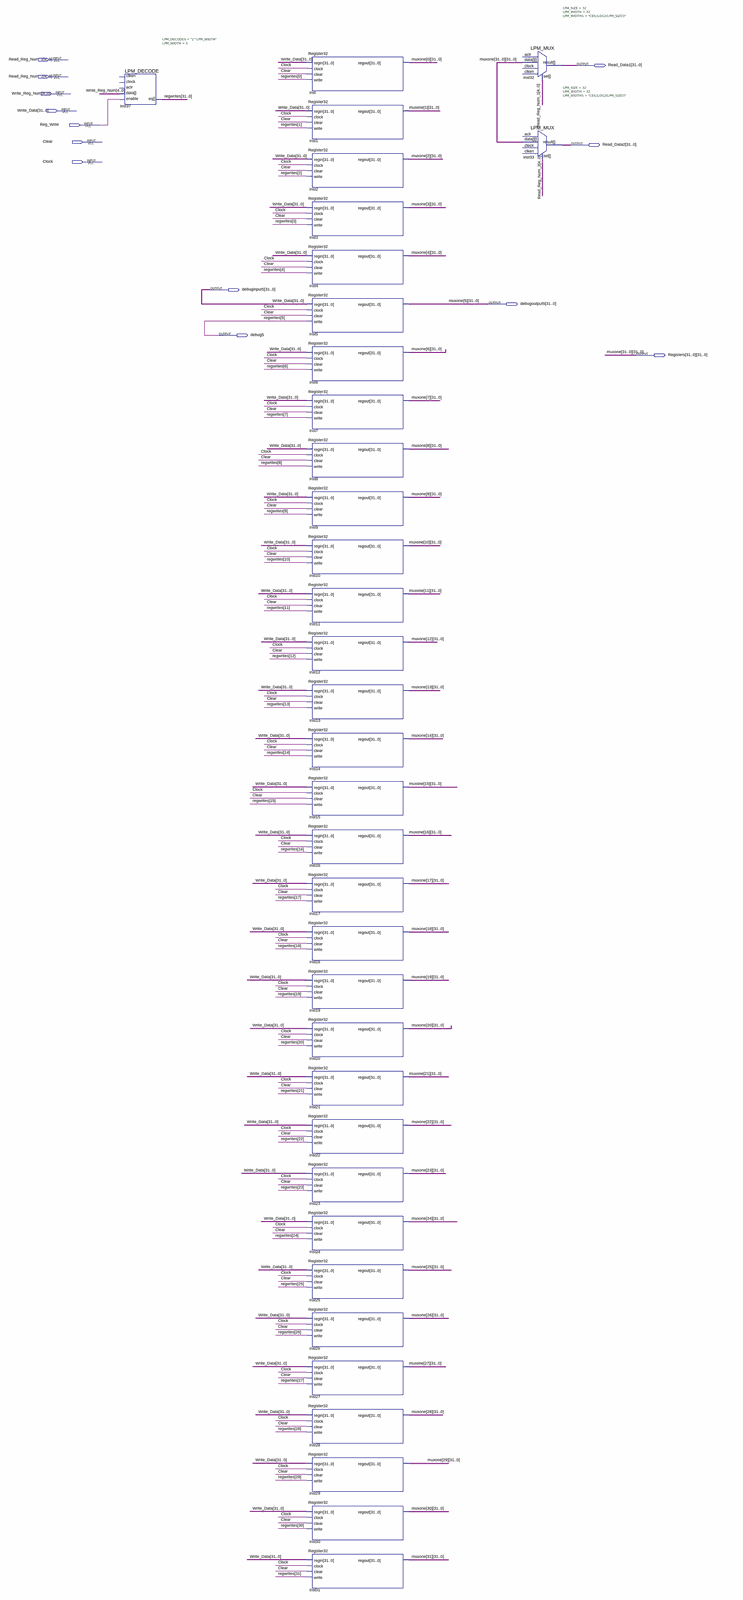
[diagram p0: schematic sheet, whole]
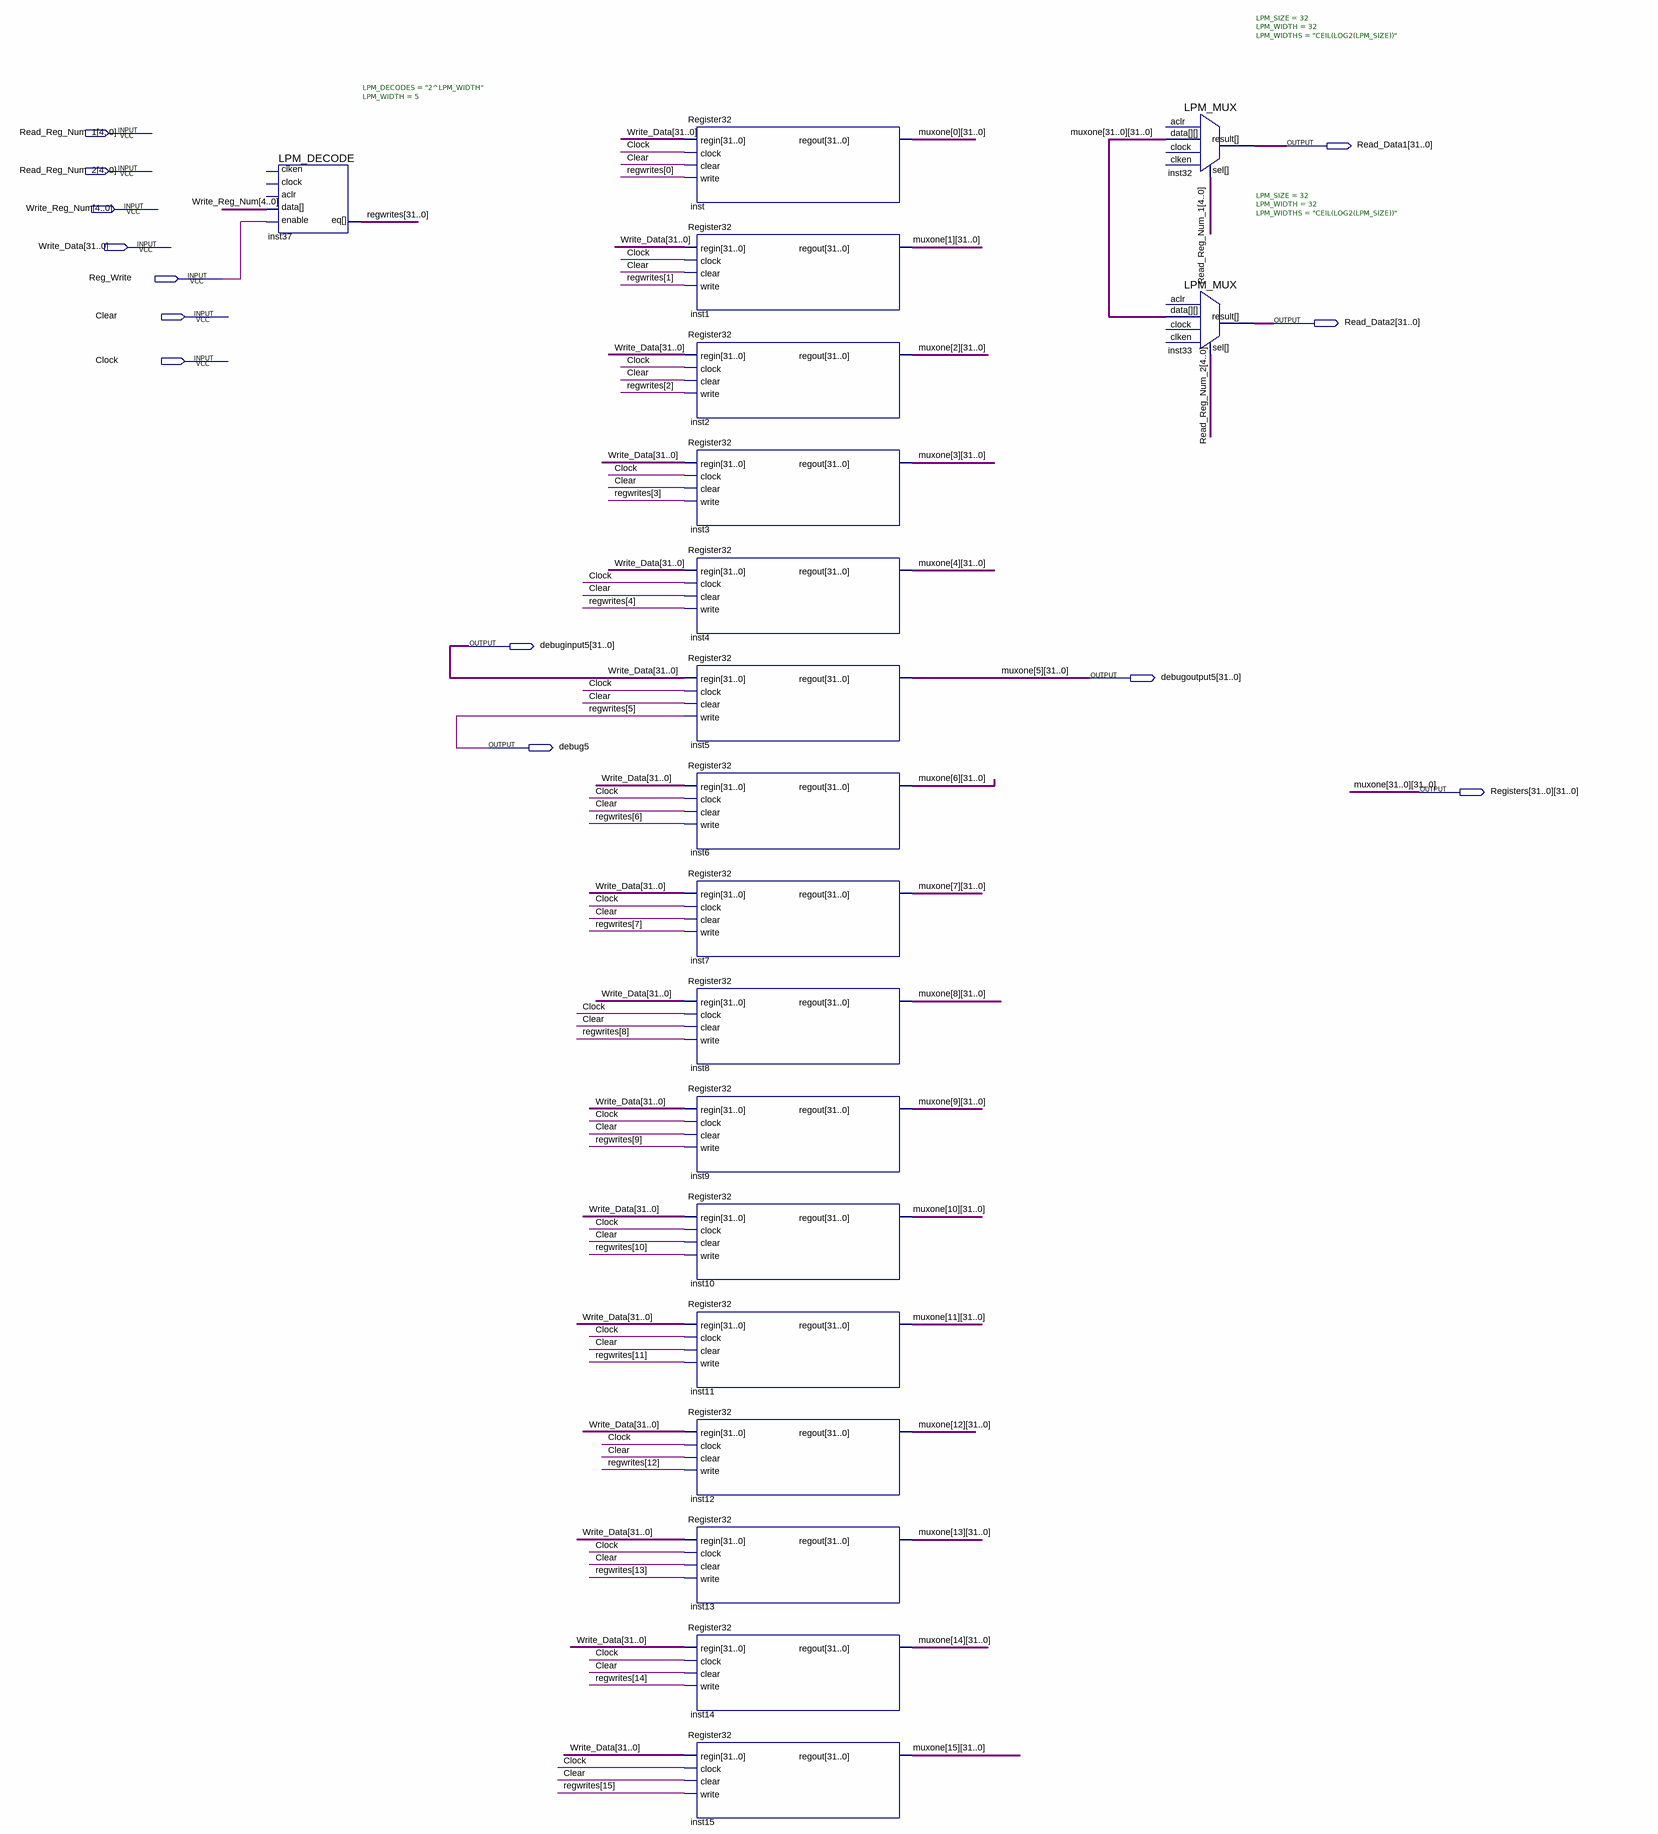
[diagram p1: schematic sheet, upper part]
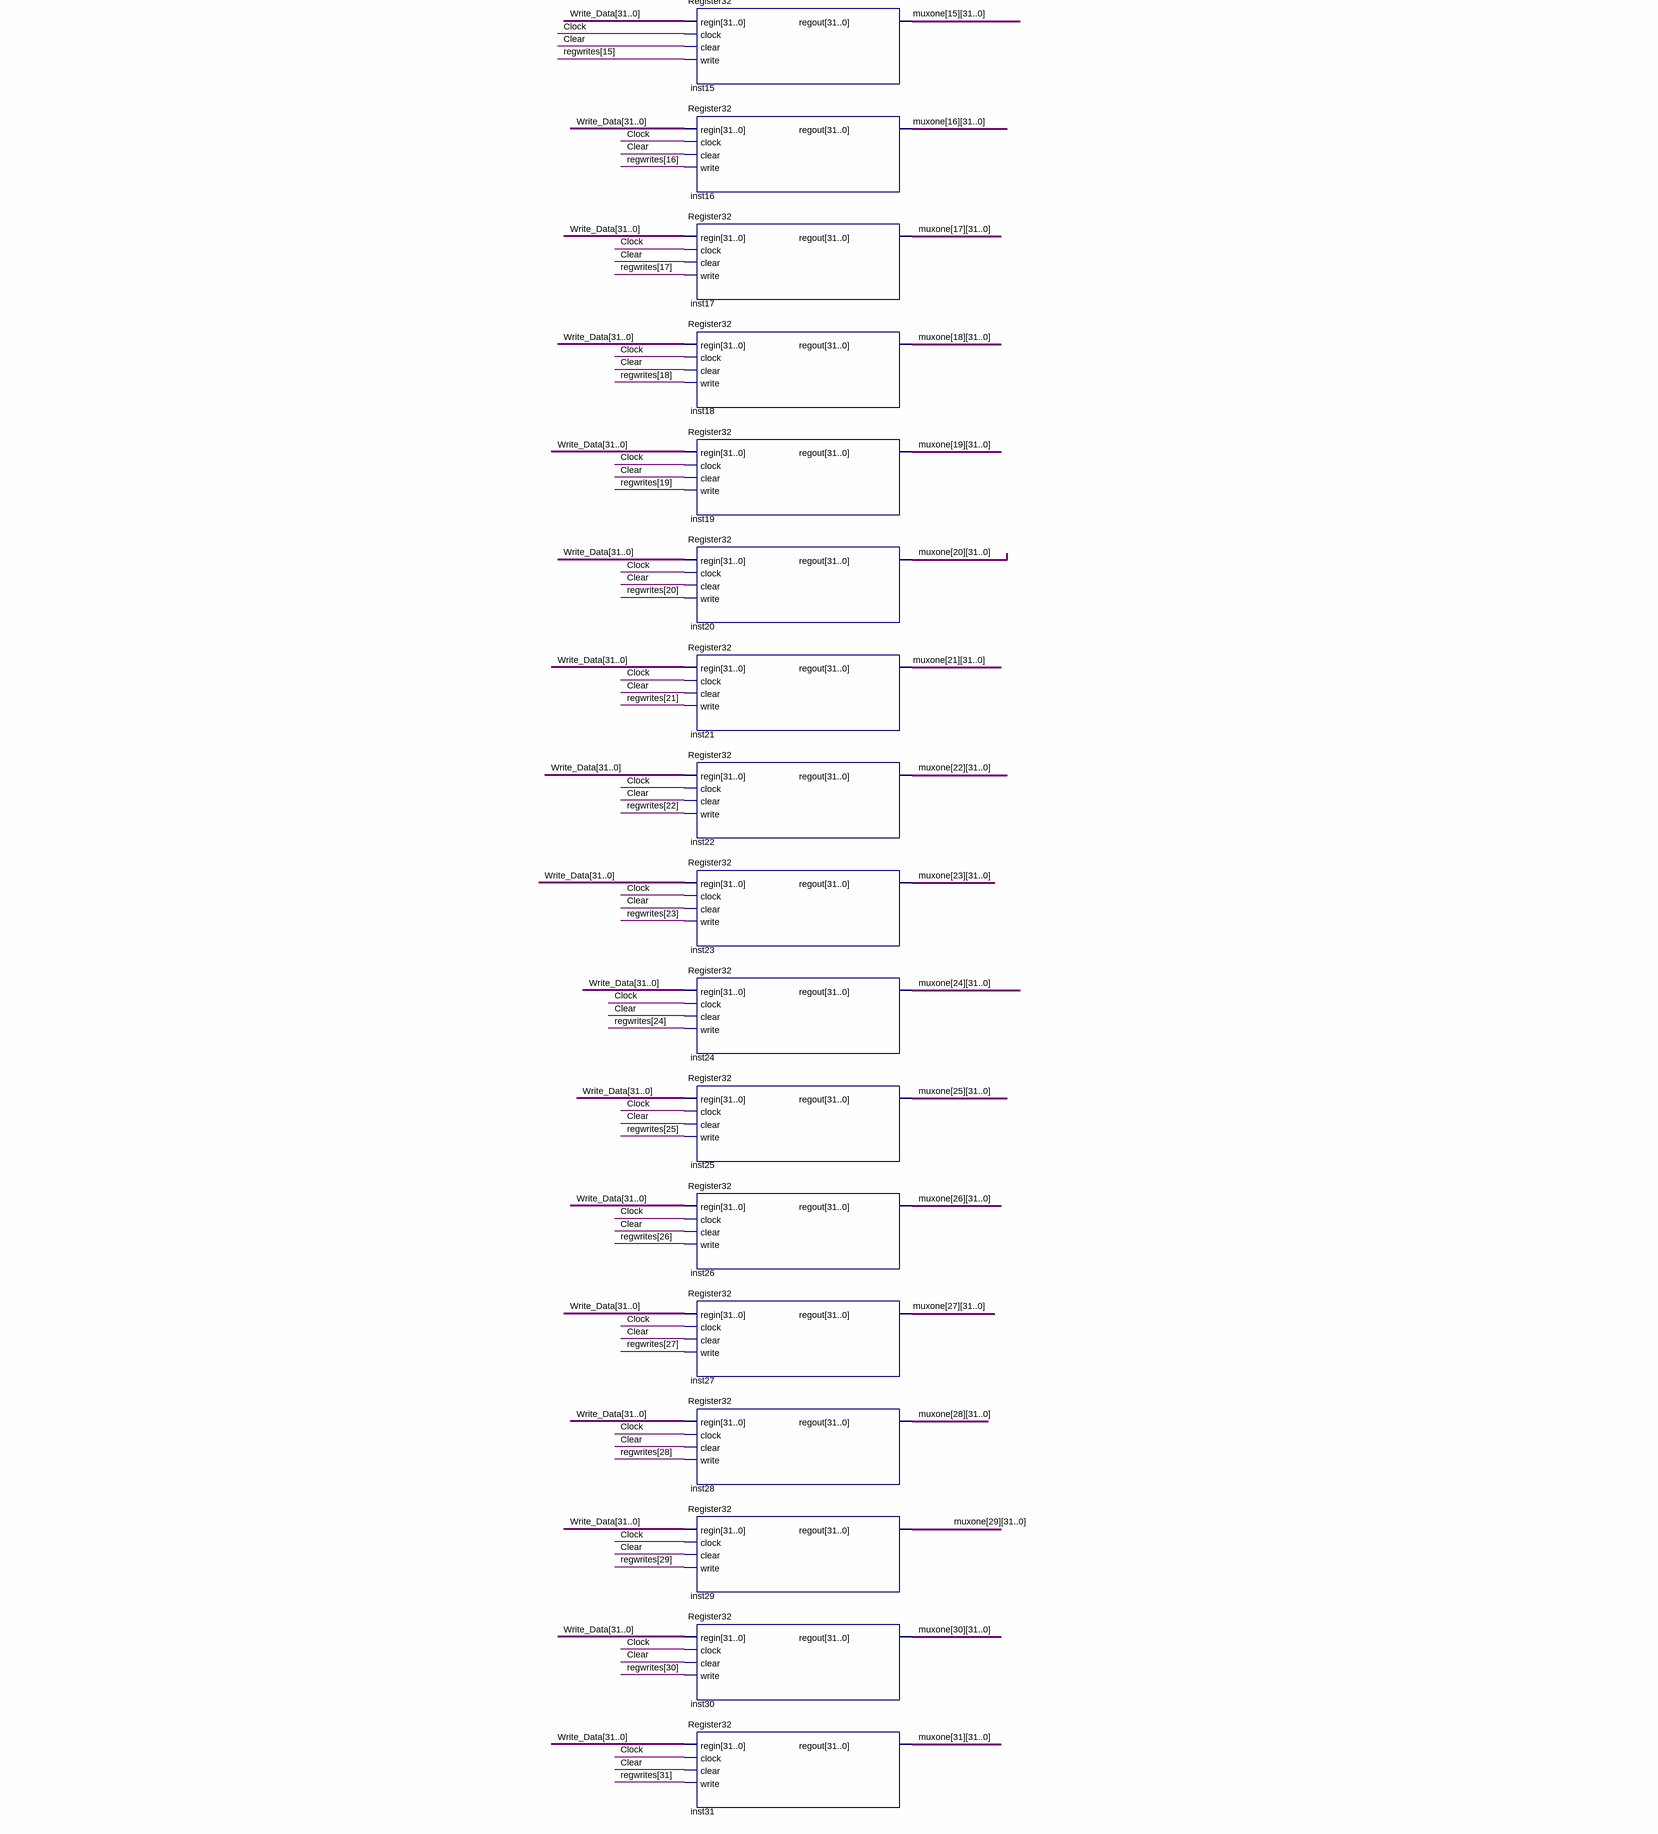
[diagram p2: schematic sheet, lower part]
// Quartus schematic Register_File.bdf as structural Verilog: 35 symbols, 13 pins
module Register_File (
  input  [4:0] Read_Reg_Num_1,
  input  [4:0] Read_Reg_Num_2,
  input  [4:0] Write_Reg_Num,
  input  [31:0] Write_Data,
  input  Reg_Write,
  input  Clear,
  input  Clock,
  output [31:0] Read_Data1,
  output [31:0] Read_Data2,
  output [31:0] debuginput5,
  output [31:0] debugoutput5,
  output debug5,
  output [31:0] Registers_31,
  output [31:0] Registers_30,
  output [31:0] Registers_29,
  output [31:0] Registers_28,
  output [31:0] Registers_27,
  output [31:0] Registers_26,
  output [31:0] Registers_25,
  output [31:0] Registers_24,
  output [31:0] Registers_23,
  output [31:0] Registers_22,
  output [31:0] Registers_21,
  output [31:0] Registers_20,
  output [31:0] Registers_19,
  output [31:0] Registers_18,
  output [31:0] Registers_17,
  output [31:0] Registers_16,
  output [31:0] Registers_15,
  output [31:0] Registers_14,
  output [31:0] Registers_13,
  output [31:0] Registers_12,
  output [31:0] Registers_11,
  output [31:0] Registers_10,
  output [31:0] Registers_9,
  output [31:0] Registers_8,
  output [31:0] Registers_7,
  output [31:0] Registers_6,
  output [31:0] Registers_5,
  output [31:0] Registers_4,
  output [31:0] Registers_3,
  output [31:0] Registers_2,
  output [31:0] Registers_1,
  output [31:0] Registers_0
);

  wire [31:0] regwrites;

  LPM_DECODE #(.LPM_DECODES("2^LPM_WIDTH"), .LPM_WIDTH(5)) inst37 (
    .enable(Reg_Write), .data(Write_Reg_Num), .eq({regwrites[31:6], debug5, regwrites[4:0]}));  // open: clken, clock, aclr
  Register32 inst (.regin(Write_Data), .clock(Clock), .clear(Clear), .write(regwrites[0]), .regout(Registers_0));
  Register32 inst1 (.regin(Write_Data), .clock(Clock), .clear(Clear), .write(regwrites[1]), .regout(Registers_1));
  Register32 inst2 (.regin(Write_Data), .clock(Clock), .clear(Clear), .write(regwrites[2]), .regout(Registers_2));
  Register32 inst3 (.regin(Write_Data), .clock(Clock), .clear(Clear), .write(regwrites[3]), .regout(Registers_3));
  Register32 inst4 (.regin(Write_Data), .clock(Clock), .clear(Clear), .write(regwrites[4]), .regout(Registers_4));
  Register32 inst5 (.regin(Write_Data), .clock(Clock), .clear(Clear), .write(debug5), .regout(debugoutput5));
  Register32 inst6 (.regin(Write_Data), .clock(Clock), .clear(Clear), .write(regwrites[6]), .regout(Registers_6));
  Register32 inst7 (.regin(Write_Data), .clock(Clock), .clear(Clear), .write(regwrites[7]), .regout(Registers_7));
  Register32 inst8 (.regin(Write_Data), .clock(Clock), .clear(Clear), .write(regwrites[8]), .regout(Registers_8));
  Register32 inst9 (.regin(Write_Data), .clock(Clock), .clear(Clear), .write(regwrites[9]), .regout(Registers_9));
  Register32 inst10 (.regin(Write_Data), .clock(Clock), .clear(Clear), .write(regwrites[10]), .regout(Registers_10));
  Register32 inst11 (.regin(Write_Data), .clock(Clock), .clear(Clear), .write(regwrites[11]), .regout(Registers_11));
  Register32 inst12 (.regin(Write_Data), .clock(Clock), .clear(Clear), .write(regwrites[12]), .regout(Registers_12));
  Register32 inst13 (.regin(Write_Data), .clock(Clock), .clear(Clear), .write(regwrites[13]), .regout(Registers_13));
  Register32 inst14 (.regin(Write_Data), .clock(Clock), .clear(Clear), .write(regwrites[14]), .regout(Registers_14));
  Register32 inst15 (.regin(Write_Data), .clock(Clock), .clear(Clear), .write(regwrites[15]), .regout(Registers_15));
  Register32 inst16 (.regin(Write_Data), .clock(Clock), .clear(Clear), .write(regwrites[16]), .regout(Registers_16));
  Register32 inst17 (.regin(Write_Data), .clock(Clock), .clear(Clear), .write(regwrites[17]), .regout(Registers_17));
  Register32 inst18 (.regin(Write_Data), .clock(Clock), .clear(Clear), .write(regwrites[18]), .regout(Registers_18));
  Register32 inst19 (.regin(Write_Data), .clock(Clock), .clear(Clear), .write(regwrites[19]), .regout(Registers_19));
  Register32 inst20 (.regin(Write_Data), .clock(Clock), .clear(Clear), .write(regwrites[20]), .regout(Registers_20));
  Register32 inst21 (.regin(Write_Data), .clock(Clock), .clear(Clear), .write(regwrites[21]), .regout(Registers_21));
  Register32 inst22 (.regin(Write_Data), .clock(Clock), .clear(Clear), .write(regwrites[22]), .regout(Registers_22));
  Register32 inst23 (.regin(Write_Data), .clock(Clock), .clear(Clear), .write(regwrites[23]), .regout(Registers_23));
  Register32 inst24 (.regin(Write_Data), .clock(Clock), .clear(Clear), .write(regwrites[24]), .regout(Registers_24));
  Register32 inst25 (.regin(Write_Data), .clock(Clock), .clear(Clear), .write(regwrites[25]), .regout(Registers_25));
  Register32 inst26 (.regin(Write_Data), .clock(Clock), .clear(Clear), .write(regwrites[26]), .regout(Registers_26));
  Register32 inst27 (.regin(Write_Data), .clock(Clock), .clear(Clear), .write(regwrites[27]), .regout(Registers_27));
  Register32 inst28 (.regin(Write_Data), .clock(Clock), .clear(Clear), .write(regwrites[28]), .regout(Registers_28));
  Register32 inst29 (.regin(Write_Data), .clock(Clock), .clear(Clear), .write(regwrites[29]), .regout(Registers_29));
  Register32 inst30 (.regin(Write_Data), .clock(Clock), .clear(Clear), .write(regwrites[30]), .regout(Registers_30));
  Register32 inst31 (.regin(Write_Data), .clock(Clock), .clear(Clear), .write(regwrites[31]), .regout(Registers_31));
  LPM_MUX #(.LPM_SIZE(32), .LPM_WIDTH(32), .LPM_WIDTHS("CEIL(LOG2(LPM_SIZE))")) inst32 (
    .data({Registers_31, Registers_30, Registers_29, Registers_28, Registers_27, Registers_26, Registers_25, Registers_24, Registers_23, Registers_22, Registers_21, Registers_20, Registers_19, Registers_18, Registers_17, Registers_16, Registers_15, Registers_14, Registers_13, Registers_12, Registers_11, Registers_10, Registers_9, Registers_8, Registers_7, Registers_6, debugoutput5, Registers_4, Registers_3, Registers_2, Registers_1, Registers_0}),
    .sel(Read_Reg_Num_1), .result(Read_Data1));  // open: clock, aclr, clken
  LPM_MUX #(.LPM_SIZE(32), .LPM_WIDTH(32), .LPM_WIDTHS("CEIL(LOG2(LPM_SIZE))")) inst33 (
    .data({Registers_31, Registers_30, Registers_29, Registers_28, Registers_27, Registers_26, Registers_25, Registers_24, Registers_23, Registers_22, Registers_21, Registers_20, Registers_19, Registers_18, Registers_17, Registers_16, Registers_15, Registers_14, Registers_13, Registers_12, Registers_11, Registers_10, Registers_9, Registers_8, Registers_7, Registers_6, debugoutput5, Registers_4, Registers_3, Registers_2, Registers_1, Registers_0}),
    .sel(Read_Reg_Num_2), .result(Read_Data2));  // open: clock, aclr, clken

  assign debuginput5 = Write_Data;
  assign Registers_5 = debugoutput5;

  // Other names for the same wires on the sheet: muxone_0[31:0] = Registers_0; muxone_1[31:0] = Registers_1;
  //   muxone_2[31:0] = Registers_2; muxone_3[31:0] = Registers_3; muxone_4[31:0] = Registers_4;
  //   muxone_5[31:0] = debugoutput5; muxone_6[31:0] = Registers_6; muxone_7[31:0] = Registers_7;
  //   muxone_8[31:0] = Registers_8; muxone_9[31:0] = Registers_9; muxone_10[31:0] = Registers_10;
  //   muxone_11[31:0] = Registers_11; muxone_12[31:0] = Registers_12; muxone_13[31:0] = Registers_13;
  //   muxone_14[31:0] = Registers_14; muxone_15[31:0] = Registers_15; muxone_16[31:0] = Registers_16;
  //   muxone_17[31:0] = Registers_17; muxone_18[31:0] = Registers_18; muxone_19[31:0] = Registers_19;
  //   muxone_20[31:0] = Registers_20; muxone_21[31:0] = Registers_21; muxone_22[31:0] = Registers_22;
  //   muxone_23[31:0] = Registers_23; muxone_24[31:0] = Registers_24; muxone_25[31:0] = Registers_25;
  //   muxone_26[31:0] = Registers_26; muxone_27[31:0] = Registers_27; muxone_28[31:0] = Registers_28;
  //   muxone_29[31:0] = Registers_29; muxone_30[31:0] = Registers_30; muxone_31[31:0] = Registers_31;
  //   regwrites[5] = debug5
endmodule
